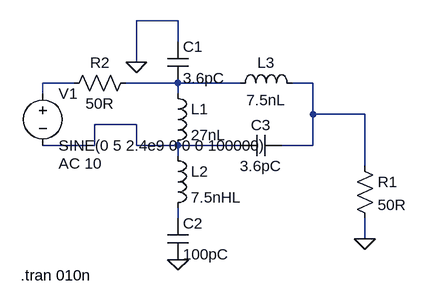
[diagram p0: schematic Draft3.asc]
Draft3.asc, the LTspice schematic file:
Version 4
SHEET 1 996 680
WIRE 128 32 64 32
WIRE 128 64 128 32
WIRE 64 96 64 32
WIRE -32 128 -80 128
WIRE 128 128 48 128
WIRE 224 128 128 128
WIRE 336 128 304 128
WIRE -80 144 -80 128
WIRE 128 144 128 128
WIRE 336 176 336 128
WIRE 416 176 336 176
WIRE 64 192 0 192
WIRE 0 224 0 192
WIRE 0 224 -80 224
WIRE 64 224 64 192
WIRE 128 224 64 224
WIRE 224 224 128 224
WIRE 336 224 336 176
WIRE 336 224 288 224
WIRE 128 240 128 224
WIRE 416 256 416 176
WIRE 128 336 128 320
WIRE 416 368 416 336
FLAG 64 96 0
FLAG 128 400 0
FLAG 416 368 0
SYMBOL cap 112 64 R0
SYMATTR InstName C1
SYMATTR Value 3.6pC
SYMBOL ind 112 128 R0
SYMATTR InstName L1
SYMATTR Value 27nL
SYMBOL ind 112 224 R0
SYMATTR InstName L2
SYMATTR Value 7.5nHL
SYMBOL cap 112 336 R0
SYMATTR InstName C2
SYMATTR Value 100pC
SYMBOL ind 208 144 R270
WINDOW 0 32 56 VTop 2
WINDOW 3 5 56 VBottom 2
SYMATTR InstName L3
SYMATTR Value 7.5nL
SYMBOL cap 288 208 R90
WINDOW 0 0 32 VBottom 2
WINDOW 3 32 32 VTop 2
SYMATTR InstName C3
SYMATTR Value 3.6pC
SYMBOL res 400 240 R0
SYMATTR InstName R1
SYMATTR Value 50R
SYMBOL voltage -80 128 R0
WINDOW 123 24 124 Left 2
WINDOW 39 0 0 Left 0
SYMATTR InstName V1
SYMATTR Value SINE(0 5 2.4e9 0 0 0 100000)
SYMATTR Value2 AC 10
SYMBOL res 64 112 R90
WINDOW 0 0 56 VBottom 2
WINDOW 3 32 56 VTop 2
SYMATTR InstName R2
SYMATTR Value 50R
TEXT -114 424 Left 2 !.tran 010n

The netlist it stands for:
* Draft3.asc
C1 0 N002 3.6pC
L1 N002 N004 27nL
L2 N004 N005 7.5nHL
C2 N005 0 100pC
L3 N002 N003 7.5nL
C3 N003 N004 3.6pC
R1 N003 0 50R
V1 N001 N004 SINE(0 5 2.4e9 0 0 0 100000) AC 10
R2 N002 N001 50R
.tran 010n
.backanno
.end